# Altium project BNV-BatteryPack_TopPCB.PrjPcb
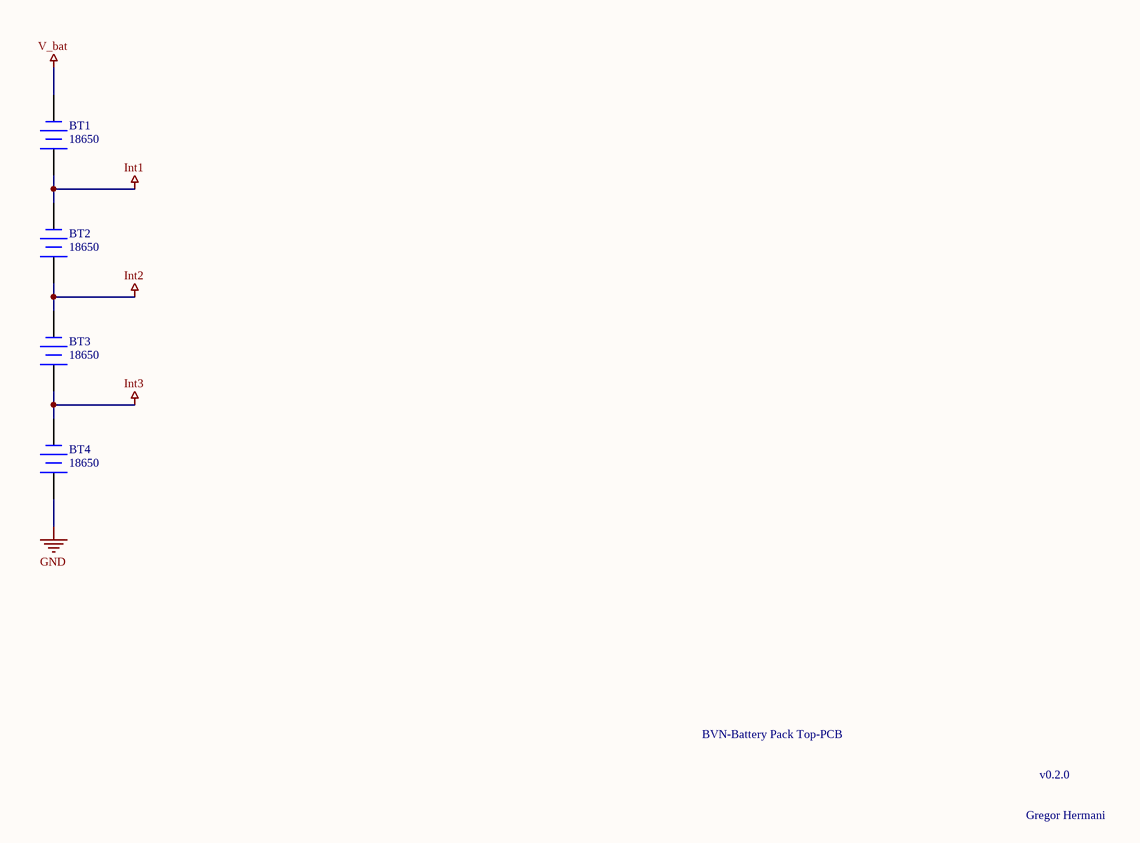
[diagram p0: Top-PCB.SchDoc]
1 sheet, 4 parts. Net scope: global (net labels, ports and power ports of the same name join across sheets).
Board file: Top-PCB.PcbDoc

## Sheet Top-PCB.SchDoc
size A4; SheetNumber: 1; SheetTotal: 1

### Parts
BT1  18650  [BAT-2]
BT2  18650  [BAT-2]
BT3  18650  [BAT-2]
BT4  18650  [BAT-2]

### Nets
GND: BT4.1(+)
Int1: BT1.1(+) BT2.2(-)
Int2: BT2.1(+) BT3.2(-)
Int3: BT3.1(+) BT4.2(-)
V_bat: BT1.2(-)

### Notes on the sheet
- BVN-Battery Pack Top-PCB
- v0.2.0
- Gregor Hermani

### Library data of the parts
BT1-BT4 = Battery: Multicell Battery; Published: 24-Mar-1999; LatestRevisionDate: 17-Jul-2002; LatestRevisionNote: Re-released for DXP Platform.; PackageReference: BAT-2; Publisher: Altium Limited; PackageDescription: Battery; 2 Leads